# Altium schematic sheet ECG_Regulator.SchDoc
size D; SheetNumber: 2; SheetTotal: 2
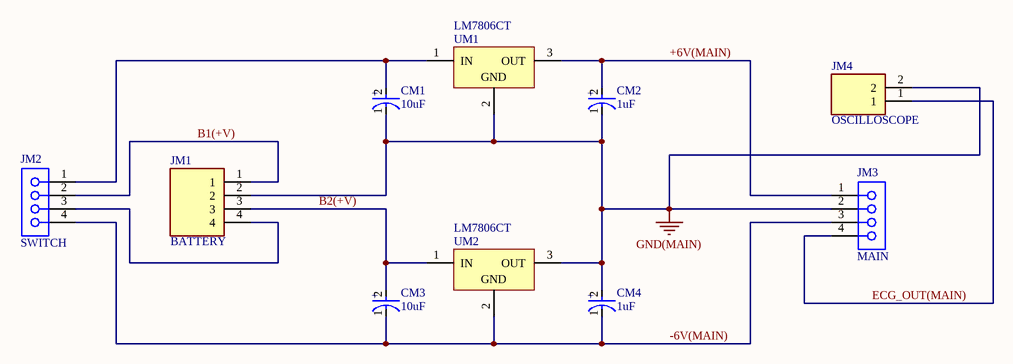
[diagram p0: ECG_Regulator.SchDoc]

## Parts
CM1  10uF  [FP-RAD-TH-D_6_3_0_5-L_11-MFG]
CM2  1uF  [FP-RAD-TH-D_6_3_0_5-L_11-MFG]
CM3  10uF  [FP-RAD-TH-D_6_3_0_5-L_11-MFG]
CM4  1uF  [FP-RAD-TH-D_6_3_0_5-L_11-MFG]
JM1  BATTERY  [CUI_TB001-500-04BE]
JM2  SWITCH  [SMTC-SLW-104-01-X-S]
JM3  MAIN  [SMTC-SLW-104-01-X-S]
JM4  OSCILLOSCOPE  [CUI_TB001-500-02BE]
UM1  LM7806CT  [TO220]
UM2  LM7806CT  [TO220]

## Nets
GND(MAIN): CM1.1(C) CM2.1(C) CM4.2(A) JM1.2 JM3.2 JM4.2 UM1.2(GND) UM2.3(OUT)
+6V(MAIN): CM2.2(A) JM3.1 UM1.3(OUT)
-6V(MAIN): CM3.1(C) CM4.1(C) JM2.4 JM3.3 UM2.2(GND)
B1(+V): JM1.1 JM2.2
B2(+V): CM3.2(A) JM1.3 UM2.1(IN)
ECG_OUT(MAIN): JM3.4 JM4.1
NetCM1_2: CM1.2(A) JM2.1 UM1.1(IN)
NetJM1_4: JM1.4 JM2.3

## Notes on the sheet
- (in symbol CMP-001-00083-1) +

## Library data of the parts
CM1-CM4 = CMP-001-00083-1: Cap Aluminum Lytic 100uF 25V 20% (6.3 X 11.2mm) Radial 2.5mm 130mA 1000h 105°C Ammo Pack
JM1 = TB001-500-04BE: MF: {'manufacturer': u'CUI Devices'}; Package: None; MP: TB001-500-04BE; Price: None; Availability: Unavailable; Value: *
JM2 JM3 = CMP-1023-00130-1: Low Profile Socket Strips, Through-hole, Vertical, -55 to 125 degC, 2.54 mm Pitch, 4-Pin, Female, RoHS; Manufacturer: Samtec; PartNumber: SLW-104-01-G-S; Pitch: 2.54 mm; PackageReference: SLW-104-01-X-S; Orientation: Vertical; ComponentLink1Description: Manufacturer URL; PackageVersion: X, 9/1987; RoHS: True; Temperature Range: -55 to 125 degC; DatasheetVersion: F-214; ComponentLink3URL: http://www.samtec.com/documents/webfiles/cpdf/SLW-1XX-01-X-X-MKT.pdf; Mounting Technology: Through-hole; PackageDescription: Low Profile Socket Strip; ComponentLink2Description: Datasheet; ComponentLink3Description: Package Specification; ComponentLink2URL: http://www.samtec.com/documents/webfiles/pdf/SLW.PDF; ComponentLink1URL: http://www.samtec.com
JM4 = TB001-500-02BE: MF: {'manufacturer': u'CUI Devices'}; MP: TB001-500-02BE; Availability: Unavailable; Package: None; Price: None; Value: *
UM1 UM2 = CMP-0244-00495-1: Positive Voltage Regulator, 6V, 3-Pin TO-220; PackageDescription: TO, Thru-Hole, Vertical, Heatsink Mounted; 3 In-Line Leads; Pitch 2.54 mm; ComponentLink3Description: Package Specification; PackageReference: TO220; PackageVersion: ver3.0; DatasheetVersion: 16/11/2011; ComponentLink3URL: http://www.st.com/internet/com/TECHNICAL_RESOURCES/TECHNICAL_LITERATURE/PACKAGE_INFORMATION/CD00004649.pdf; ComponentLink2Description: Datasheet; ComponentLink2URL: http://www.st.com/internet/com/TECHNICAL_RESOURCES/TECHNICAL_LITERATURE/DATASHEET/CD00000444.pdf; ComponentLink1Description: Manufacturer URL; ComponentLink1URL: http://www.st.com